# Altium schematic sheet Battery Management.SchDoc
size A4; DocumentNumber: 1; SheetNumber: 1; SheetTotal: 2
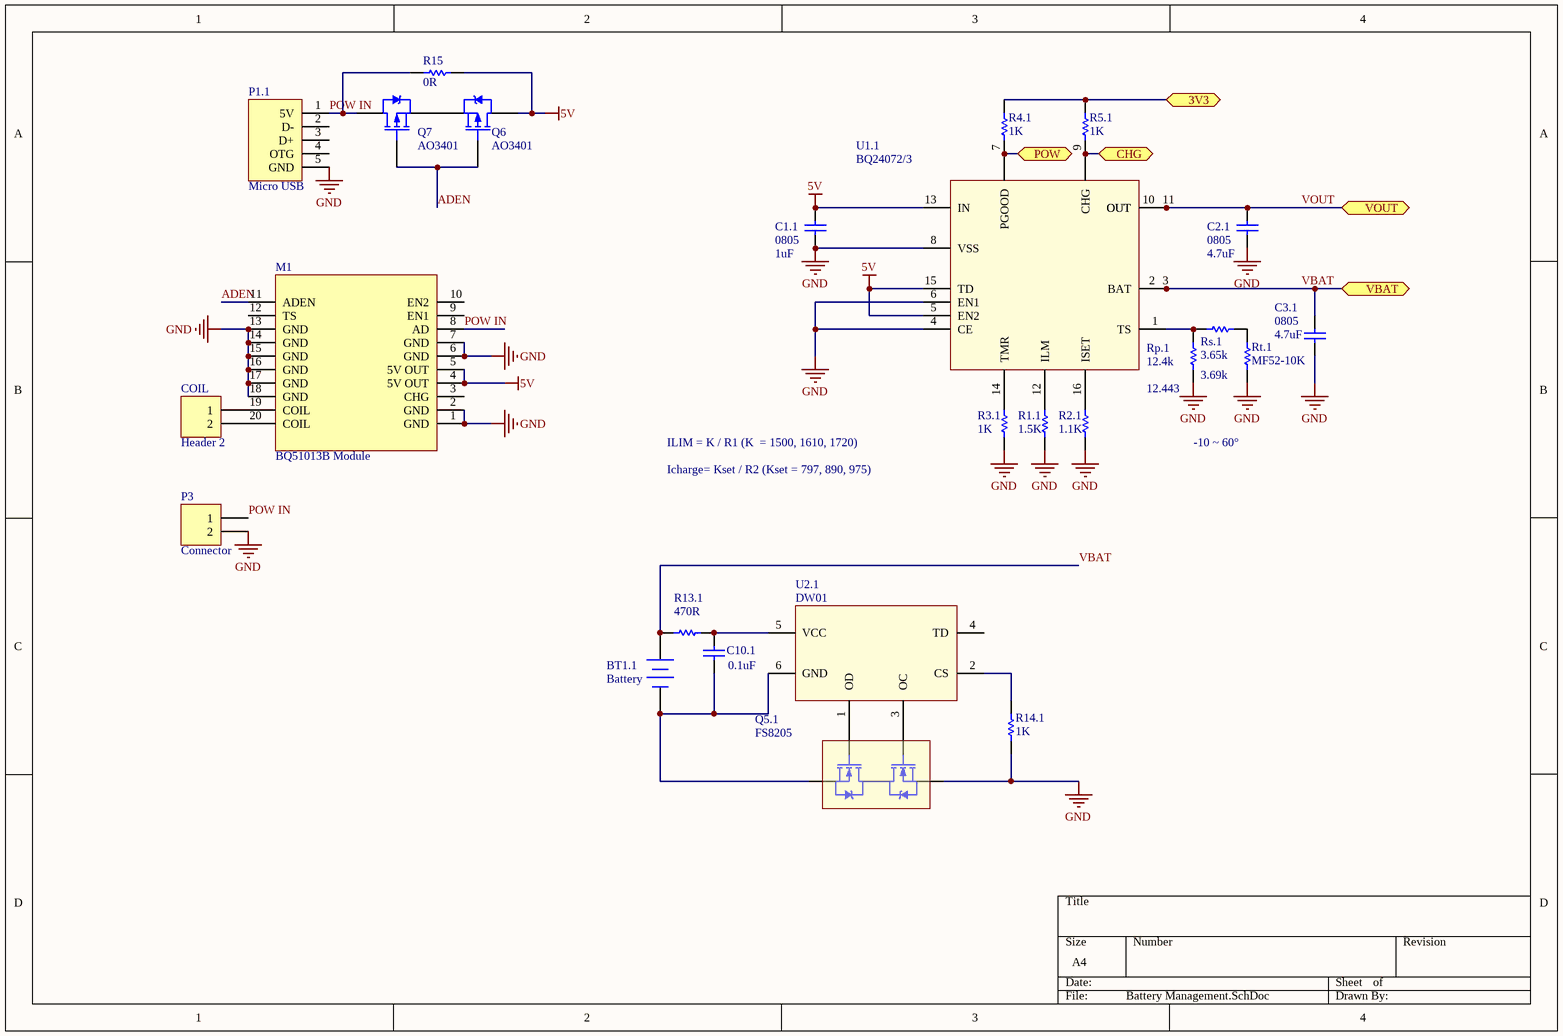
[diagram p0: Battery Management.SchDoc]

## Parts
BT1.1  Battery  [BAT-2]
C1.1  0805  value 1uF  [D0805]
C2.1  0805  value 4.7uF  [D0805]
C3.1  0805  value 4.7uF  [D0805]
C10.1  value 0.1uF  [D0603]  (hidden comment: 0603)
COIL  Header 2  [HDR1X2 1.27]
M1  BQ51013B Module  [BQ51013B_BT]
P1.1  Micro USB  [Micro.Horn]
P3  Connector  [HDR1X2 1.27]
Q5.1  FS8205  [SOT23-6_N]
Q6  AO3401  [SOT23_N]
Q7  AO3401  [SOT23_N]
R1.1  value 1.5K  [D0603]  (hidden comment: 0603)
R2.1  value 1.1K  [D0603]  (hidden comment: 0603)
R3.1  value 1K  [D0603]  (hidden comment: 0603)
R4.1  value 1K  [D0603]  (hidden comment: 0603)
R5.1  value 1K  [D0603]  (hidden comment: 0603)
R13.1  value 470R  [D0603]  (hidden comment: 0603)
R14.1  value 1K  [D0603]  (hidden comment: 0603)
R15  value 0R  [D0603]  (hidden comment: 0603)
Rp.1  value 12.4k  [D0603]  (hidden comment: 0603)
Rs.1  value 3.65k  [D0603]  (hidden comment: 0603)
Rt.1  value MF52-10K  [D0603]  (hidden comment: 0603)
U1.1  BQ24072/3  [QFN16]
U2.1  DW01  [SOT23-6_N]

## Ports
3V3, CHG, POW, VBAT, VOUT

## Nets
5V: C1.1.1 M1.4(5V_OUT) M1.5(5V_OUT) Q6.2(D) R15.1 U1.1.5(EN2) U1.1.13(IN) U1.1.15(TD)
GND: C1.1.2 C2.1.2 C3.1.2 M1.1(GND) M1.2(GND) M1.6(GND) M1.7(GND) M1.13(GND) M1.14(GND) M1.15(GND) M1.16(GND) M1.17(GND) M1.18(GND) P1.1.5(GND) P3.2 Q5.1.3(S2) R1.1.1 R2.1.1 R3.1.1 R14.1.1 Rp.1.1 Rt.1.2 U1.1.4(CE) U1.1.6(EN1) U1.1.8(VSS)
3V3: R4.1.2 R5.1.2 ; port 3V3
ADEN: M1.11(ADEN) Q6.1(G) Q7.1(G)
CHG: R5.1.1 U1.1.9(CHG) ; port CHG
POW: R4.1.1 U1.1.7(PGOOD) ; port POW
POW IN: M1.8(AD) P1.1.1(5V) P3.1 Q7.2(D) R15.2
VBAT: BT1.1.1(+) C3.1.1 R13.1.1 U1.1.2(BAT) U1.1.3(BAT) ; port VBAT
VOUT: C2.1.1 U1.1.10(OUT) U1.1.11(OUT) ; port VOUT
NetBT1.1_2: BT1.1.2(-) C10.1.1 Q5.1.1(S1) U2.1.6(GND)
NetC10.1_2: C10.1.2 R13.1.2 U2.1.5(VCC)
NetCOIL_1: COIL.1 M1.19(COIL)
NetCOIL_2: COIL.2 M1.20(COIL)
NetQ5.1_4: Q5.1.4(G2) U2.1.3(OC)
NetQ5.1_6: Q5.1.6(G1) U2.1.1(OD)
NetQ6_3: Q6.3(S) Q7.3(S)
NetR1.1_2: R1.1.2 U1.1.12(ILM)
NetR2.1_2: R2.1.2 U1.1.16(ISET)
NetR3.1_2: R3.1.2 U1.1.14(TMR)
NetR14.1_2: R14.1.2 U2.1.2(CS)
NetRp.1_2: Rp.1.2 Rs.1.2 U1.1.1(TS)
NetRs.1_1: Rs.1.1 Rt.1.1

Not connected (* = marked no-connect by the designer): M1 3(CHG) 9(EN1) 10(EN2) 12(TS); P1.1 2(D-) 3(D+) 4(OTG); Q5.1 2(D12) 5(D12); U2.1 4(TD)

## Notes on the sheet
- (near Rp.1) 3.69k
- ILIM = K / R1 (K  = 1500, 1610, 1720)
- 12.443
- -10 ~ 60°
- Icharge= Kset / R2 (Kset = 797, 890, 975)

## Library data of the parts
BT1.1 = Battery: Multicell Battery; Published: 24-Mar-1999; LatestRevisionDate: 17-Jul-2002; LatestRevisionNote: Re-released for DXP Platform.; PackageReference: BAT-2; Publisher: Altium Limited; PackageDescription: Battery; 2 Leads
C1.1 C2.1 C3.1 C10.1 = Cap: Capacitor; Published: 8-Jun-2000; LatestRevisionDate: 17-Jul-2002; LatestRevisionNote: Re-released for DXP Platform.; PackageReference: RAD-0.3; Publisher: Altium Limited; PackageDescription: Radial Cap, Thru-Hole; 2 Leads; 0.3 in Pin Spacing
COIL P3 = Header 2: Header, 2-Pin; LatestRevisionDate: 17-Jul-2002; LatestRevisionNote: Re-released for DXP Platform.; Publisher: Altium Limited
M1 = BQ51013B-BT
P1.1 = Micro USB Horn: MIcro USB Connector Horn
Q5.1 = FS8205: FS8205 Dual MOS
Q6 Q7 = AO3401: AO3401 P-Channel MOSFET
R1.1 R2.1 R3.1 R4.1 R5.1 R13.1 R14.1 R15 Rp.1 Rs.1 Rt.1 = Res1: Resistor; Published: 8-Jun-2000; LatestRevisionDate: 17-Jul-2002; LatestRevisionNote: Re-released for DXP Platform.; PackageReference: AXIAL-0.3; Publisher: Altium Limited; PackageDescription: Axial Device, Thru-Hole; 2 Leads; 0.3 in Pin Spacing
U1.1 = BQ24073: Standalone Battery Management Chip
U2.1 = DW01: Battery Protector